# EAGLE design Water Leak Detector PCB (EAGLE 8.2.1)
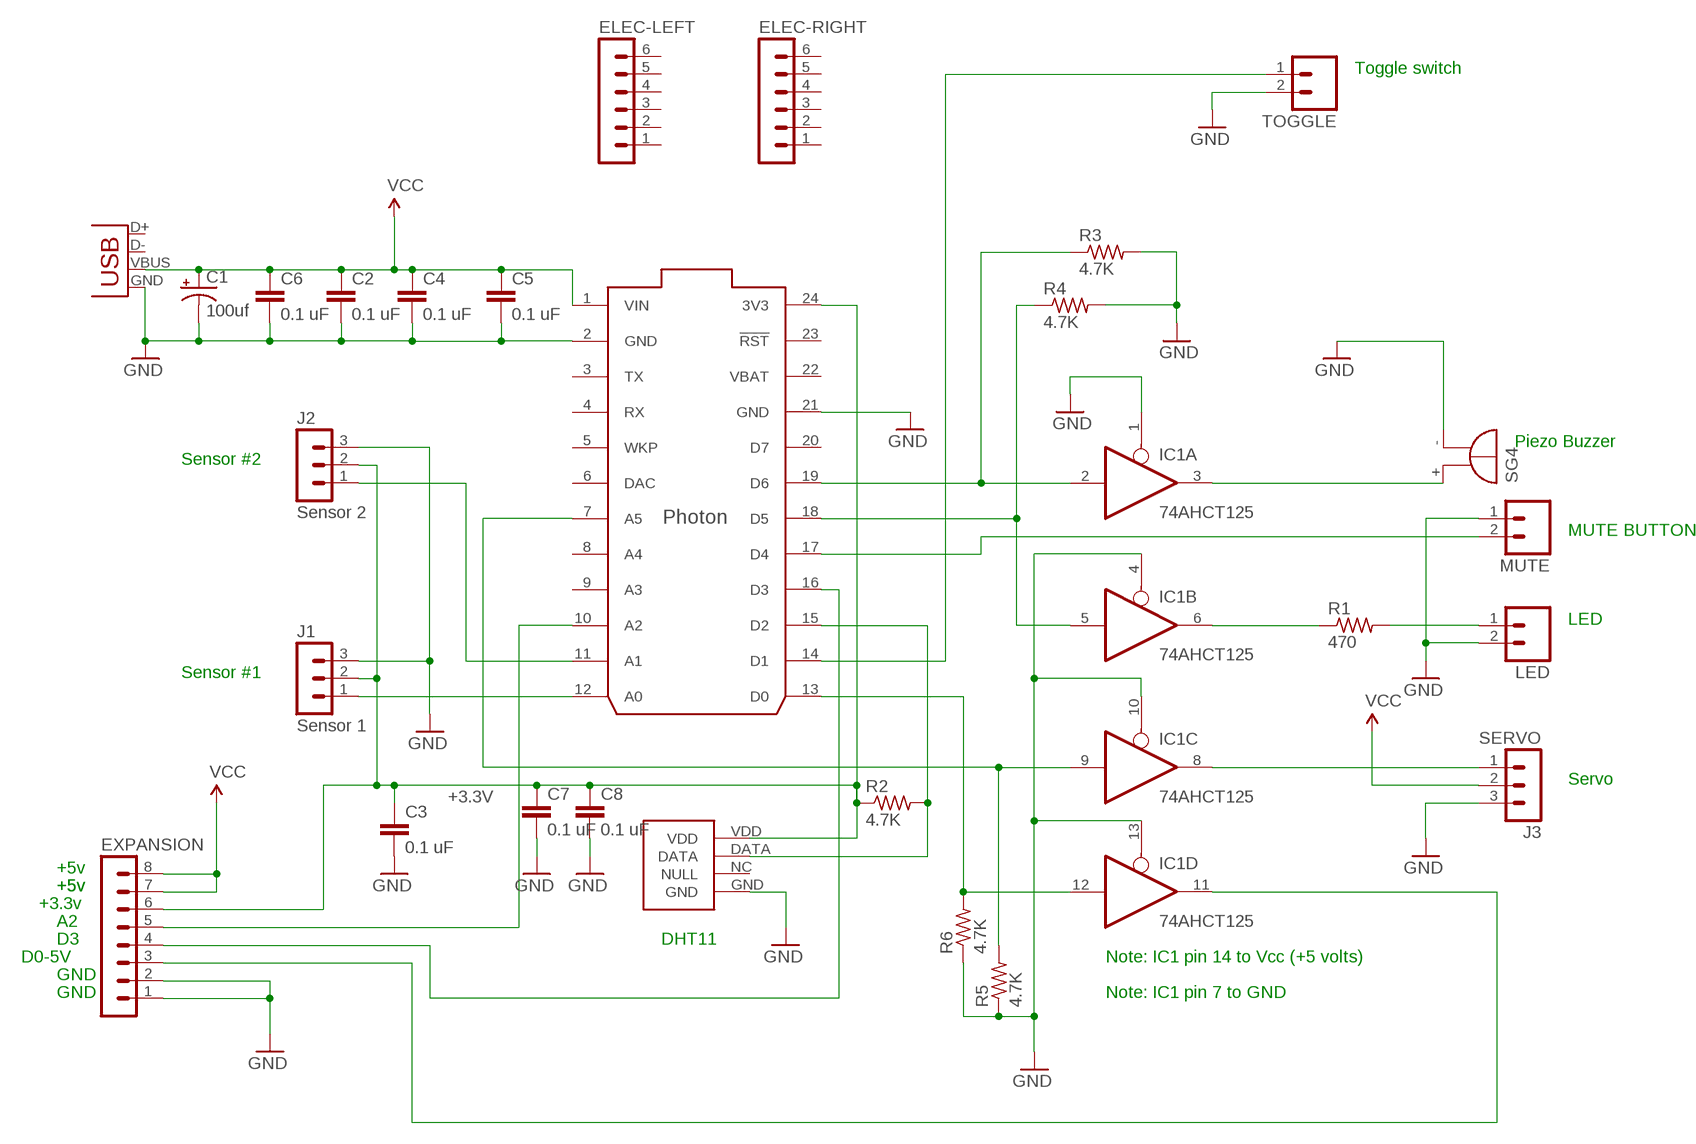
[diagram p0: schematic, sheet 1]

## Parts
C1  100uf  CAP_POLPTH1  [CPOL-RADIAL-100UF-25V]
C2  0.1 uF  CAPPTH  [CAP-PTH-SMALL]
C3  0.1 uF  CAPPTH  [CAP-PTH-SMALL]
C4  0.1 uF  CAPPTH  [CAP-PTH-SMALL]
C5  0.1 uF  CAPPTH  [CAP-PTH-SMALL]
C6  0.1 uF  CAPPTH  [CAP-PTH-SMALL]
C7  0.1 uF  CAPPTH  [CAP-PTH-SMALL]
C8  0.1 uF  CAPPTH  [CAP-PTH-SMALL]
ELEC-LEFT  MA06-1  [MA06-1]
ELEC-RIGHT  MA06-1  [MA06-1]
EXPANSION  MA08-1  [MA08-1]
IC1  74AHCT125  74125N  [DIL14]
J1  Sensor 1  MA03-1  [MA03-1]
J2  Sensor 2  MA03-1  [MA03-1]
J3  SERVO  MA03-1  [MA03-1]
JP1  USB-B  USBPTH  [USB-B-PTH]
LED  M02PTH  [1X02]
MUTE  M02PTH  [1X02]
R1  470  R-US_0309/12  [0309/12]
R2  4.7K  R-US_0309/12  [0309/12]
R3  4.7K  R-US_0309/12  [0309/12]
R4  4.7K  R-US_0309/12  [0309/12]
R5  4.7K  R-US_0309/12  [0309/12]
R6  4.7K  R-US_0309/12  [0309/12]
SG4  F/HMB  [F/HMB]
TOGGLE  M02PTH  [1X02]
U$1  PHOTON_WITH_HEADERS  [PHOTON]
U$2  DHT22  [DHT22]

## Nets
+3.3V: C3.1 C7.1 C8.1 EXPANSION.6 J1.2 J2.2 R2.1 U$1.24(3V3) U$2.VDD
GND: C1.2(-) C2.2 C3.2 C4.2 C5.2 C6.2 C7.2 C8.2 EXPANSION.1 EXPANSION.2 IC1.1(A:OE) IC1.4(B:OE) IC1.10(C:OE) IC1.13(D:OE) J1.3 J2.3 J3.3 JP1.GND LED.2 MUTE.1 R3.2 R4.2 R5.1 R6.1 SG4.- TOGGLE.2 U$1.2(GND) U$1.21(GND) U$2.GND
N$1: IC1.8(C:O) J3.1
N$2: J2.1 U$1.11(A1)
N$3: J1.1 U$1.12(A0)
N$4: IC1.2(A:I) R3.1 U$1.19(D6)
N$6: IC1.3(A:O) SG4.+
N$7: IC1.9(C:I) R5.2 U$1.7(A5)
N$9: IC1.6(B:O) R1.1
N$10: LED.1 R1.2
N$11: MUTE.2 U$1.17(D4)
N$14: EXPANSION.4 U$1.16(D3)
N$15: EXPANSION.3 IC1.11(D:O)
N$16: EXPANSION.5 U$1.10(A2)
N$17: IC1.12(D:I) R6.2 U$1.13(D0)
N$19: R2.2 U$1.15(D2) U$2.DATA
N$22: TOGGLE.1 U$1.14(D1)
N$23: IC1.5(B:I) R4.1 U$1.18(D5)
VCC: C1.1(+) C2.1 C4.1 C5.1 C6.1 EXPANSION.7 EXPANSION.8 J3.2 JP1.VBUS U$1.1(VIN)
Unconnected: ELEC-LEFT.1 ELEC-LEFT.2 ELEC-LEFT.3 ELEC-LEFT.4 ELEC-LEFT.5 ELEC-LEFT.6 ELEC-RIGHT.1 ELEC-RIGHT.2 ELEC-RIGHT.3 ELEC-RIGHT.4 ELEC-RIGHT.5 ELEC-RIGHT.6 JP1.D+ JP1.D- U$1.3(TX) U$1.4(RX) U$1.5(WKP) U$1.6(DAC) U$1.8(A4) U$1.9(A3) U$1.20(D7) U$1.23(!RST) U$2.NC(NULL)

## Notes on the sheet
- Toggle switch
- Piezo Buzzer
- Sensor #2
- MUTE BUTTON
- LED
- Sensor #1
- Servo
- +5v
- +5v | +5v
- +3.3v
- A2
- D3 | DHT11
- D0-5V | Note: IC1 pin 14 to Vcc (+5 volts)
- GND
- GND | Note: IC1 pin 7 to GND

## Power pins joined to a net without a drawn wire
GND: IC1.7(P:GND)
VBAT: U$1.22(VBAT)
VCC: IC1.14(P:VCC)

## Library data of the parts
C1 = SparkFun-Capacitors:CAP_POL: Capacitor Polarized These are standard SMD and PTH capacitors. Normally 10uF, 47uF, and 100uF in electrolytic and tantalum varieties. Always verify the external diameter of the through hole cap, it varies with capacity, voltage, and manufacturer. The EIA devices should be standard.
C2-C8 = SparkFun-Passives:CAP: Capacitor Standard 0603 ceramic capacitor, and 0.1" leaded capacitor.
ELEC-LEFT ELEC-RIGHT = con-lstb:MA06-1: PIN HEADER; OC_FARNELL: unknown; OC_NEWARK: unknown
EXPANSION = con-lstb:MA08-1: PIN HEADER; OC_FARNELL: unknown; OC_NEWARK: unknown
IC1 = 74xx-us:74*125: Quad bus BUFFER, 3-state
J1-J3 = con-lstb:MA03-1: PIN HEADER; OC_FARNELL: unknown; OC_NEWARK: unknown
JP1 = SparkFun-Connectors:USB: USB Connectors USB-B-PTH is fully proven SKU : PRT-00139/CONN-08278 USB-miniB is fully proven SKU : PRT-00587 USB-A-PCB is untested. USB-A-H is throughly reviewed, but untested. Spark Fun Electronics SKU : PRT-00437 USB-B-SMT is throughly reviewed, but untested. Needs silkscreen touching up. USB-A-S has not been used/tested USB-MB-H has not been used/tested USB-MICROB has been used. CONN-09505; PROD_ID: CONN-08278
LED MUTE TOGGLE = SparkFun-Connectors:M02: Standard 2-pin 0.1" header. Use with - straight break away headers ( PRT-00116) - right angle break away headers (PRT-00553) - swiss pins (PRT-00743) - machine pins (PRT-00117) - female headers (PRT-00115) Molex polarized connector foot print use with: PRT-08233 with associated crimp pins and housings. 2.54_SCREWTERM for use with PRT-10571. 3.5mm Screw Terminal footprints for PRT-08084 5mm Screw Terminal footprints for use with PRT-08433
R1-R6 = rcl:R-US_: RESISTOR, American symbol
SG4 = buzzer:F/HMB: BUZZER Source: Buerklin; OC_FARNELL: unknown; OC_NEWARK: unknown
U$1 = Spark:PHOTON
U$2 = Spark:DHT22

## Board
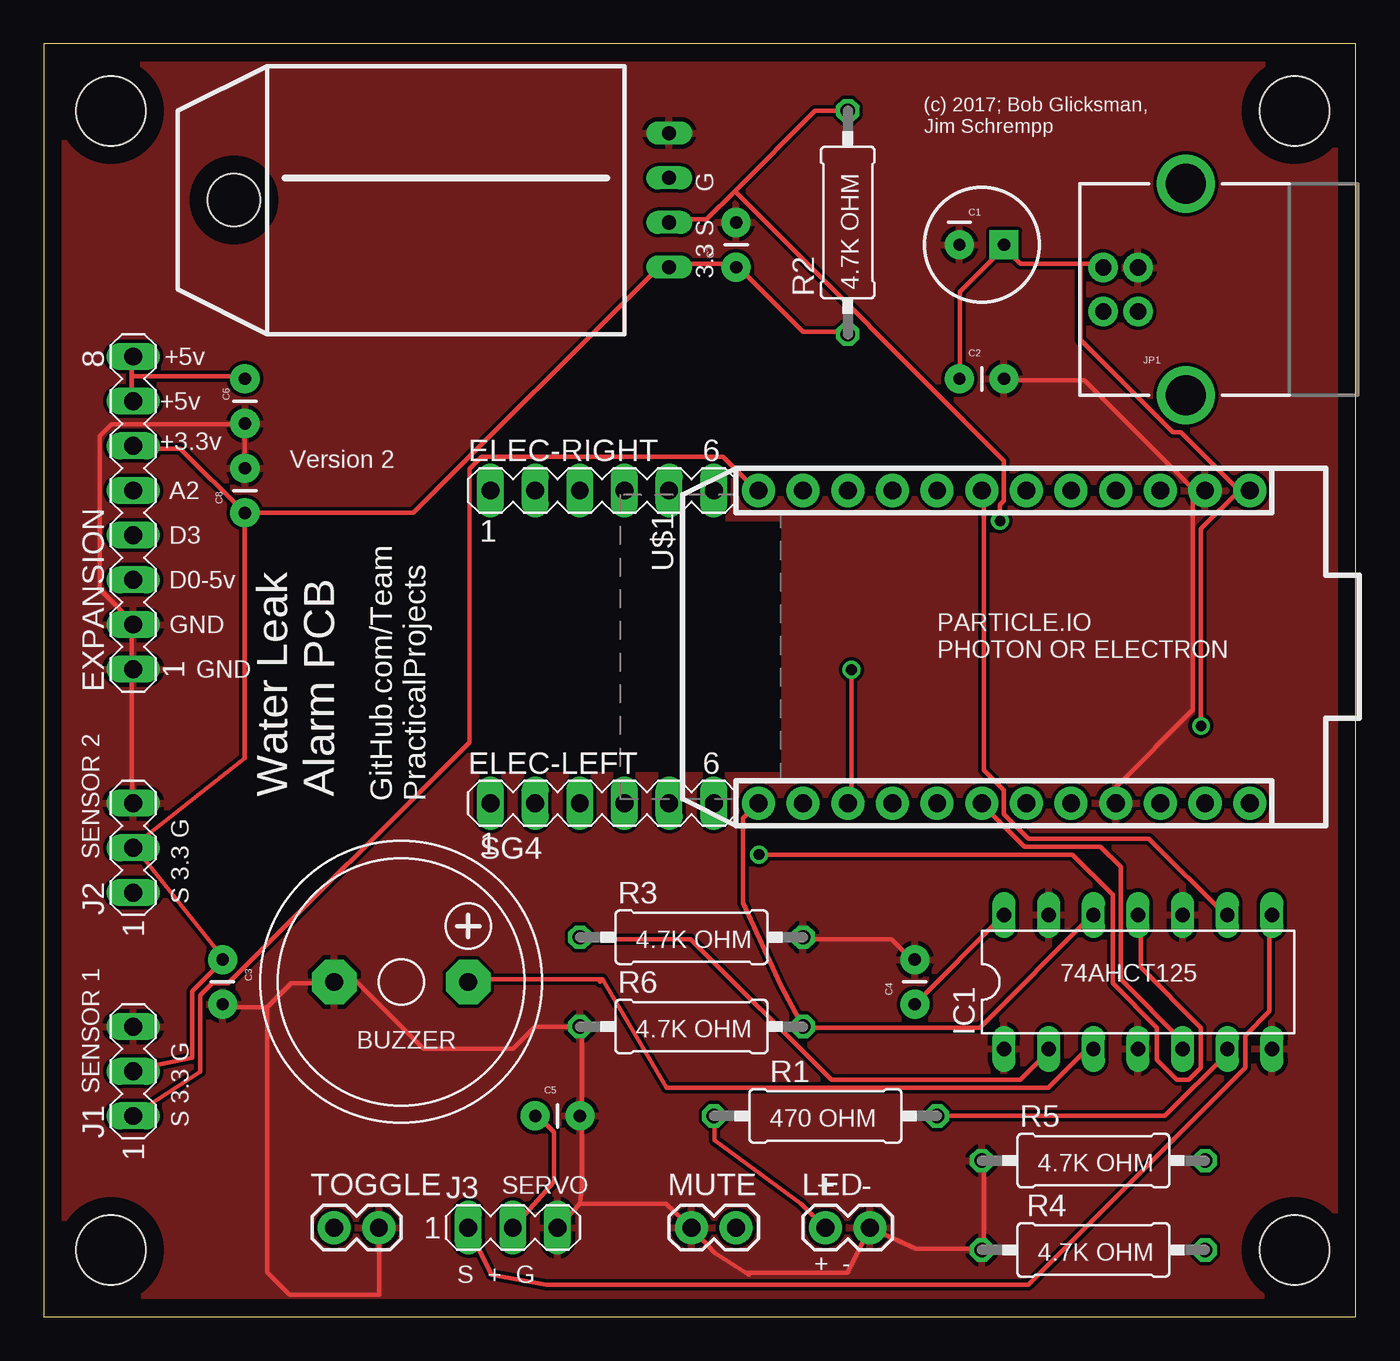
[diagram p1: board, top side]
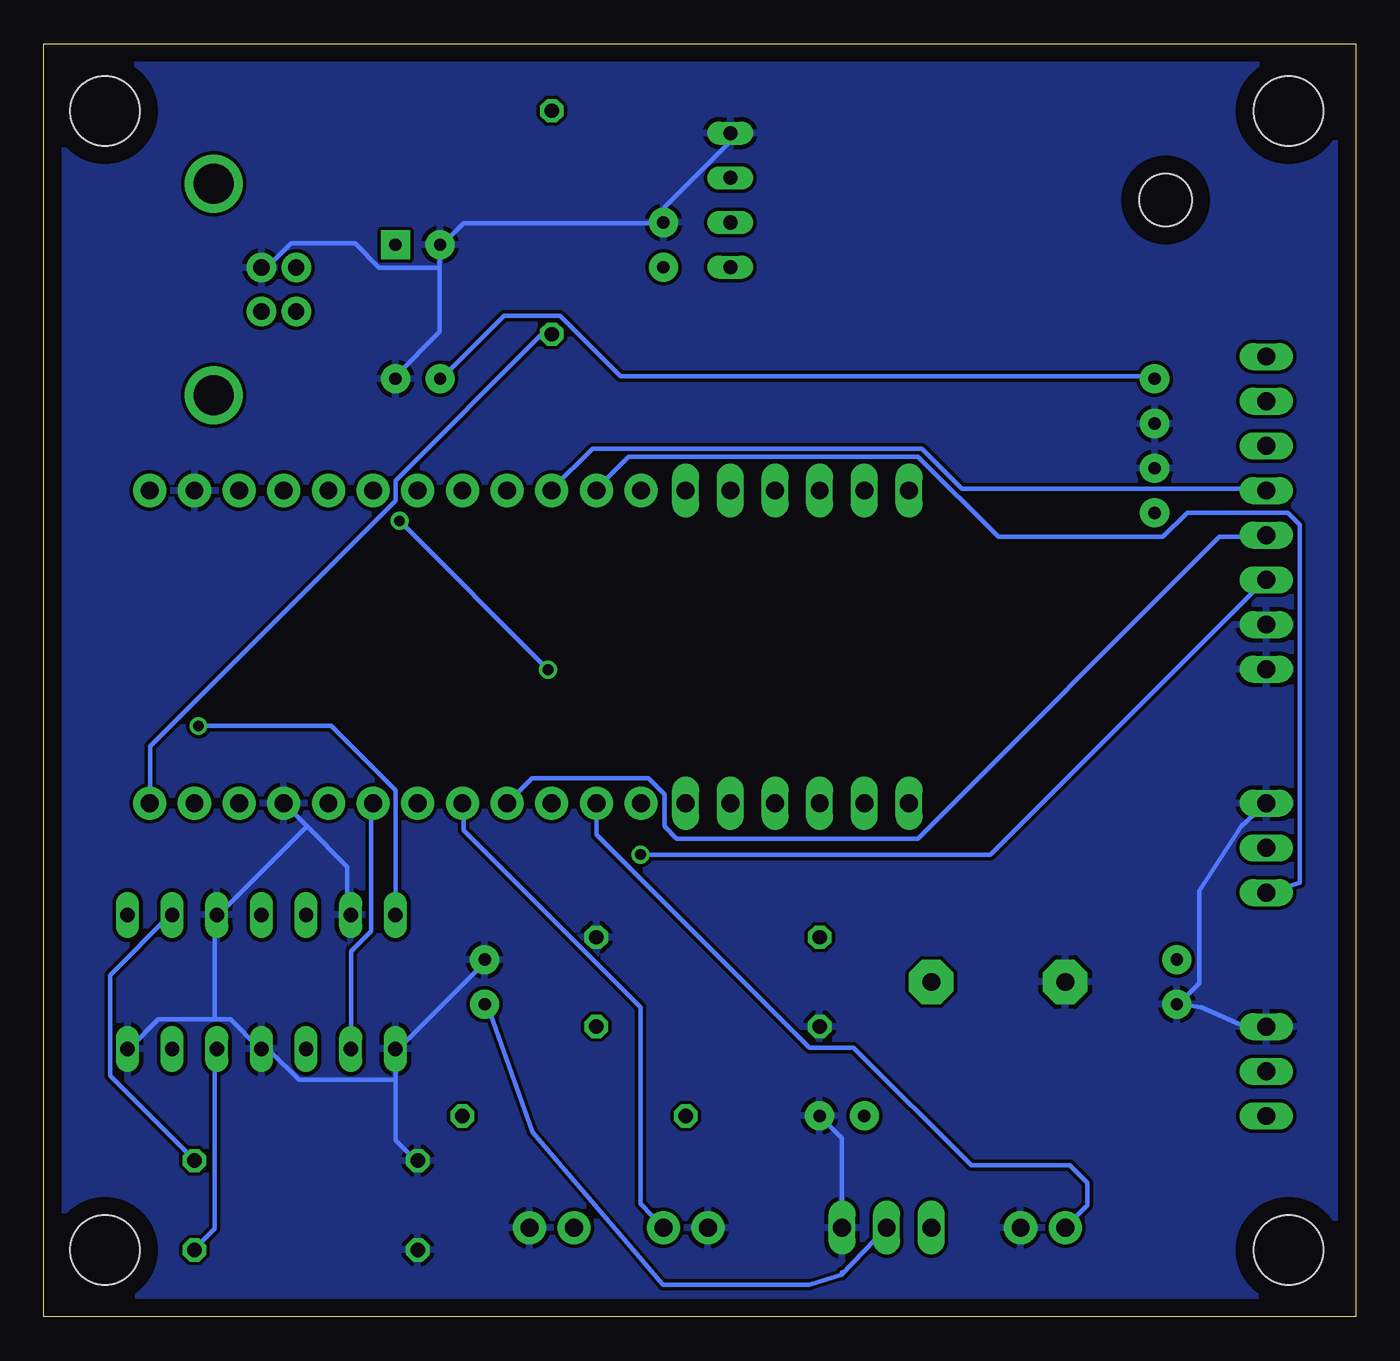
[diagram p2: board, bottom side, seen from below]

Size 74.6 x 72.38 mm. Coordinates in mm from the lower left corner, seen from the top.
Outline: 0,0 74.6,0 74.6,72.38 0,72.38 0,0
Copper layers (1*16): Top 0.035mm / dielectric 1.5mm / Bottom 0.035mm
Design rules "default": minimum track width 10mil, minimum drill 24mil, track to track 8mil, track to pad 8mil, pad to pad 8mil, via to via 8mil, smd to smd 8mil, copper to edge 40mil, drill to drill 8mil, minimum pad ring 10mil, minimum via ring 8mil, stop-mask expansion 4mil, vias tented up to drill 0mil, thermal gap 10mil
Holes 3.96 mm at 71.12,3.81 71.12,68.58 3.81,3.81 3.81,68.58
tKeepout: area 24.4,31 to 41.9,45.2
bKeepout: area 24.4,31 to 41.9,45.2
tRestrict: area 24.4,31 to 41.9,45.2
bRestrict: area 24.4,31 to 41.9,45.2

### Footprints (pad centres in the part's own frame; a part is rotated, then mirrored left to right if it is on the bottom)
CPOL-RADIAL-100UF-25V = drill 0.7 pad 1.651 square: 1 1.27,0 | drill 0.7 pad 1.651: 2 -1.27,0
CAP-PTH-SMALL = drill 0.7 pad 1.651: 1 0,0; 2 2.54,0
MA06-1 = drill 1.016 long: 1 -6.35,0; 2 -3.81,0; 3 -1.27,0; 4 1.27,0; 5 3.81,0; 6 6.35,0
MA08-1 = drill 1.016 long: 1 -8.89,0; 2 -6.35,0; 3 -3.81,0; 4 -1.27,0; 5 1.27,0; 6 3.81,0; 7 6.35,0; 8 8.89,0
DIL14 = drill 0.813 long: 1 -7.62,-3.81; 2 -5.08,-3.81; 3 -2.54,-3.81; 4 0,-3.81; 5 2.54,-3.81; 6 5.08,-3.81; 7 7.62,-3.81; 8 7.62,3.81; 9 5.08,3.81; 10 2.54,3.81; 11 0,3.81; 12 -2.54,3.81; 13 -5.08,3.81; 14 -7.62,3.81
MA03-1 = drill 1.016 long: 1 -2.54,0; 2 0,0; 3 2.54,0
USB-B-PTH = drill 0.914 pad 1.676: D+ 0,1.25; D- 1.981,1.25; GND 0,-1.25; VBUS 1.981,-1.25 | drill 2.286: S1 -2.718,-6.02; S2 -2.718,6.02
1X02 = drill 1.016 pad 1.88: 1 0,0; 2 2.54,0
0309/12 = drill 0.813 octagon: 1 -6.35,0; 2 6.35,0
F/HMB = drill 1.016 pad 2.54 octagon: + 3.81,0; - -3.81,0
PHOTON = drill 1.016 pad 1.88: 1 1.27,32.258; 2 1.27,29.718; 3 1.27,27.178; 4 1.27,24.638; 5 1.27,22.098; 6 1.27,19.558; 7 1.27,17.018; 8 1.27,14.478; 9 1.27,11.938; 10 1.27,9.398; 11 1.27,6.858; 12 1.27,4.318; 13 19.05,4.318; 14 19.05,6.858; 15 19.05,9.398; 16 19.05,11.938; 17 19.05,14.478; 18 19.05,17.018; 19 19.05,19.558; 20 19.05,22.098; 21 19.05,24.638; 22 19.05,27.178; 23 19.05,29.718; 24 19.05,32.258
DHT22 = drill 0.8 long: DATA -1.27,0; GND 3.81,0; NC 1.27,0; VDD -3.81,0 | hole 3: 0,24.765

### Placement (x,y rotation side)
C1  53.34,60.96 0 top
C2  52.07,53.34 0 top
C3  10.16,20.32 270 top
C4  49.53,17.78 90 top
C5  27.94,11.43 0 top
C6  11.43,53.34 270 top
C7  39.37,59.69 90 top
C8  11.43,45.72 90 top
ELEC-LEFT  31.75,29.21 0 top
ELEC-RIGHT  31.75,46.99 0 top
EXPANSION  5.08,45.72 90 top
IC1  62.23,19.05 0 top
J1  5.08,13.97 90 top
J2  5.08,26.67 90 top
J3  26.67,5.08 0 top
JP1  62.23,58.42 180 top
LED  44.45,5.08 0 top
MUTE  36.83,5.08 0 top
R1  44.45,11.43 180 top
R2  45.72,62.23 90 top
R3  36.83,21.59 0 top
R4  59.69,3.81 180 top
R5  59.69,8.89 0 top
R6  36.83,16.51 0 top
SG4  20.32,19.05 0 top
TOGGLE  16.51,5.08 0 top
U$1  36.32,48.26 270 top
U$2  35.56,63.5 90 top

### Tracks (layer width: path | path; a pad name or v marks a point on that pad's centre or on a via)
+3.3V
  Top 0.254: 11.41,45.72 7.75,49.38 5.23,49.38 EXPANSION.6 | J1.2 5.23,14.07 8.43,14.73 8.43,18.52 10.03,20.12 C3.1 10.26,20.34 5.23,26.64 J2.2 5.23,26.87 11.41,31.77 11.41,45.72 | 11.41,45.72 C8.1 21.01,45.72 34.95,59.66 35.41,59.66 U$2.VDD 35.64,59.89 39.29,59.89 C7.1 39.52,59.66 43.18,56.01 45.7,56.01 R2.1
  Bottom 0.254: U$1.24 68.56,29.26 68.56,32.46 54.61,46.41 54.61,47.55 46.38,55.78 45.92,55.78 R2.1
GND
  Top 0.254: 11.41,50.75 11.41,48.46 C8.2 | J2.3 5,30.66 5,36.8 EXPANSION.1 5,37.03 5,39.32 EXPANSION.2 5,39.55 3.18,41.38 3.18,50.06 3.86,50.75 11.41,50.75 | 11.41,50.75 C6.2 | 30.61,11.43 30.61,16.46 R6.1 27.94,16.51 26.67,15.24 21.59,15.24 17.78,19.05 SG4.- 16.42,18.96 14.06,18.96 12.7,17.6 | 30.48,6.43 35.38,6.43 MUTE.1 38.15,3.66 40.11,2.39 39.98,2.52 45.7,2.52 LED.2 49.61,3.89 53.24,3.89 R4.2 53.47,3.89 53.47,8.69 R5.1 | 30.61,11.43 30.61,7.57 30.48,6.43 | 30.61,11.43 C5.2 | 30.48,6.43 J3.3 | C3.2 10.26,17.6 12.7,17.6 | 65.35,47.09 66.04,47.09 U$1.2 65.35,47.09 | 65.35,47.09 59.18,53.26 54.61,53.26 C2.2 | R3.2 43.18,21.49 48.21,21.49 49.35,20.34 C4.2 | 65.35,47.09 65.35,34.52 61.01,30.18 61.01,29.26 U$1.21 | TOGGLE.2 19.05,1.27 13.97,1.27 12.7,2.54 12.7,17.6
  Bottom 0.254: J1.3 6.5,16.59 6.48,16.59 8.76,17.6 C3.2 10.03,17.83 8.89,18.97 8.89,24.23 6.5,27.89 J2.3 | U$2.GND 35.64,67.21 35.64,66.75 39.29,63.09 39.29,62.41 C7.2 39.52,62.18 50.72,62.18 51.87,61.04 C1.2 52.1,60.81 52.1,59.66 | 52.1,59.66 52.1,56.01 54.61,53.49 C2.2 | 52.1,59.66 55.52,59.66 56.9,61.04 60.55,61.04 61.7,59.89 62.15,59.89 JP1.GND | U$1.21 59.64,27.89 | 59.64,27.89 57.35,25.6 57.35,22.86 IC1.13 | 54.61,13.49 54.61,10.06 53.47,8.91 R5.1 | 54.61,13.49 54.61,15.09 | 54.61,13.49 60.1,13.49 61.7,15.09 62.15,15.09 IC1.4 62.38,15.32 63.98,16.92 64.9,16.92 | 64.9,16.92 68.1,16.92 69.7,15.32 IC1.7 | 64.9,16.92 64.9,22.86 IC1.10 64.67,22.86 59.64,27.89 | 54.61,15.09 49.58,20.12 C4.2 | 54.61,15.09 IC1.1 | J3.3 29.21,10.16 C5.2
  pour Bottom: 0,72.39 74.93,72.39 74.93,0 0,0
  pour Top: 0,72.39 74.93,72.39 74.93,0 0,0
N$1
  Top 0.254: IC1.8 69.7,22.86 69.7,17.37 68.33,16 68.33,14.17 55.98,1.83 28.55,1.83 25.45,2.39 J3.1
N$2
  Bottom 0.254: J2.1 5,24.13 3.18,24.69 3.18,45.03 3.86,45.72 9.58,45.72 10.95,44.35 20.32,44.35 24.89,48.92 41.35,48.92 43.18,47.09 U$1.11
N$3
  Top 0.254: J1.1 5.23,11.56 8.89,13.95 8.89,18.29 9.58,18.97 10.49,18.97 24.21,32.69 24.21,48.23 24.89,48.92 38.61,48.92 40.44,47.09 U$1.12
N$4
  Top 0.254: R3.1 30.61,21.49 36.78,21.49 44.78,13.49 55.52,13.49 57.13,15.09 IC1.2
  Bottom 0.254: IC1.2 57.13,15.32 57.13,20.8 55.98,21.95 55.98,29.03 U$1.19
N$6
  Top 0.254: 31.77,19.2 35.41,13.03 57.13,13.03 59.18,15.09 59.64,15.09 IC1.3 | 31.77,19.2 31.62,19.05 | 31.77,19.2 24.28,19.2 SG4.+
N$7
  Top 0.254: U$1.7 53.47,46.86 53.47,31.09 54.61,29.95 54.61,28.57 55.98,27.2 62.84,27.2 67.18,22.86 IC1.9
  Bottom 0.254: R5.2 66.04,8.91 70.84,13.72 70.84,19.43 67.41,22.86 IC1.9
N$9
  Top 0.254: R1.1 63.75,11.43 67.41,15.09 IC1.6
N$10
  Top 0.254: R1.2 38.15,11.43 38.15,10.06 43.05,6.43 LED.1
N$11
  Bottom 0.254: MUTE.2 40.66,6.43 40.66,17.6 50.72,27.66 50.72,29.03 U$1.17
N$14
  Bottom 0.254: U$1.16 46.84,30.63 40.21,30.63 39.29,29.72 39.29,27.89 38.61,27.2 24.89,27.2 7.75,44.35 5.23,44.35 EXPANSION.4
N$15  (via drill 0.61)
  Top 0.254: v40.66,26.29 58.5,26.29 60.78,24 60.78,18.97 63.3,16.46 63.3,14.63 64.44,13.49 65.13,13.49 65.81,14.17 65.81,16.46 62.38,19.89 62.38,22.86 IC1.11
  Bottom 0.254: v40.66,26.29 20.78,26.29 5.23,41.83 EXPANSION.3
N$16
  Bottom 0.254: EXPANSION.5 5.23,47.09 22.38,47.09 24.66,49.38 43.41,49.38 45.7,47.09 U$1.10
N$17
  Top 0.254: U$1.13 40.44,29.03 39.75,28.35 39.75,23.55 41.91,18.85 R6.2 43.18,16.46 53.24,16.46 59.64,22.86 IC1.12
N$19  (via drill 0.61)
  Top 0.254: 39.29,64.01 43.87,68.58 R2.2 | 39.29,64.01 37.69,62.41 35.64,62.41 U$2.DATA | v45.92,36.8 45.92,29.26 U$1.15 | v54.38,45.26 54.38,46.18 54.61,46.41 54.61,48.69 39.29,64.01
  Bottom 0.254: v54.38,45.26 v45.92,36.8
N$22
  Bottom 0.254: U$1.14 43.18,27.43 31.06,15.32 28.55,15.32 21.86,8.62 16.24,8.62 15.24,7.62 15.24,6.35 TOGGLE.1
N$23
  Top 0.254: U$1.18 53.47,29.03 55.75,26.75 60.1,26.75 61.24,25.6 61.24,19.2 64.67,15.77 64.67,15.32 IC1.5
  Bottom 0.254: IC1.5 64.9,15.09 64.9,5.03 66.04,3.89 R4.1
VCC  (via drill 0.61)
  Top 0.254: J3.2 29.01,7.7 29.01,10.52 28.09,11.43 C5.1 | C4.1 IC1.14 | 5,53.49 5,54.41 EXPANSION.8 | 5,53.49 5,52.12 EXPANSION.7 | 5,53.49 11.41,53.49 C6.1 | 54.61,60.81 52.1,58.29 52.1,53.49 C2.1 | 58.95,59.89 55.52,59.89 54.61,60.81 | 58.95,59.89 60.1,59.89 JP1.VBUS | 54.61,60.81 C1.1 | 68.1,47.09 67.87,47.09 64.67,50.29 64.21,50.29 58.95,55.55 58.95,59.89 | 68.1,47.09 68.56,47.09 U$1.1 68.1,47.09 | v65.81,33.6 65.81,44.81 68.1,47.09
  Bottom 0.254: 29.23,2.39 31.06,1.83 39.4,1.83 46.81,10.52 49.35,17.6 C4.1 | 29.23,2.39 J3.2 | C6.1 11.63,53.49 41.81,53.49 45.24,56.92 48.44,56.92 51.87,53.49 C2.1 | IC1.14 54.61,29.95 58.27,33.6 v65.81,33.6 | 29.21,2.54 29.21,2.41 29.23,2.39

### Text on the board
tPlace: (c) 2017; Bob Glicksman, / Jim Schrempp | 3.3 S G | 4.7K OHM | +5v | +5v | +3.3v | Version 2 | A2 | D3 | D0-5v | GND | PARTICLE.IO / PHOTON OR ELECTRON | GND | Water Leak / Alarm PCB | GitHub.com/Team / PracticalProjects | SENSOR 2 | S 3.3 G | 4.7K OHM | 74AHCT125 | 4.7K OHM | BUZZER | SENSOR 1 | S 3.3 G | 470 OHM | 4.7K OHM | SERVO | + | - | + - | 4.7K OHM | S + G